# EAGLE design YOTSUBA_GNSS-coupler_ver.1.0 (EAGLE 9.6.2)
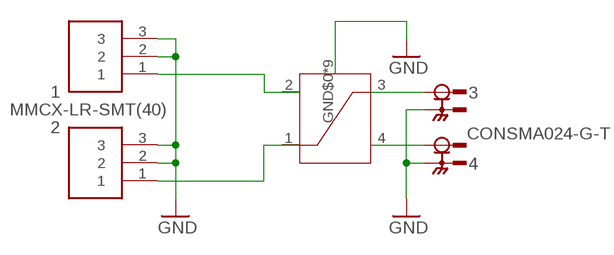
[diagram p0: schematic, sheet 1]

## Parts
1  MMCX-LR-SMT(40)  [MMCX-LR-SMT(40)]
2  MMCX-LR-SMT(40)  [MMCX-LR-SMT(40)]
3  CONSMA024-G-T  [LINX_CONSMA024-G-T]
4  CONSMA024-G-T  [LINX_CONSMA024-G-T]
U$3  HC125.A  [HC125.A]

## Nets
GND: 1.2 1.3 2.2 2.3 3.G1 3.G2 4.G1 4.G2 U$3.GND$0(GND) U$3.GND$1(GND) U$3.GND$2(GND) U$3.GND$3(GND) U$3.GND$4(GND) U$3.GND$5(GND) U$3.GND$6(GND) U$3.GND$7(GND) U$3.GND$8(GND)
N$1: 1.1 U$3.2
N$2: 2.1 U$3.1
N$3: 3.1 U$3.3
N$6: 4.1 U$3.4

## Library data of the parts
1 2 = MMCX-LR-SMT(40):MMCX-LR-SMT(40)
3 4 = CONSMA024-G-T:CONSMA024-G-T; DESCRIPTION: SMA, Edge Mount, Cutout, Female Receptacle, PCB Mount, Gold in Tape and Reel (500 per reel); DIGI-KEY_PART_NUMBER: 343-CONSMA024-G-TTR-ND; MF: Linx Technologies; MP: CONSMA024-G-T; PACKAGE: Custom Linx Technologies Inc.; PURCHASE-URL: https://pricing.snapeda.com/search/part/CONSMA024-G-T/?ref=eda
U$3 = HC125.A:HC125.A

## Net classes
0 default: clearance 0.121 mm

## Board
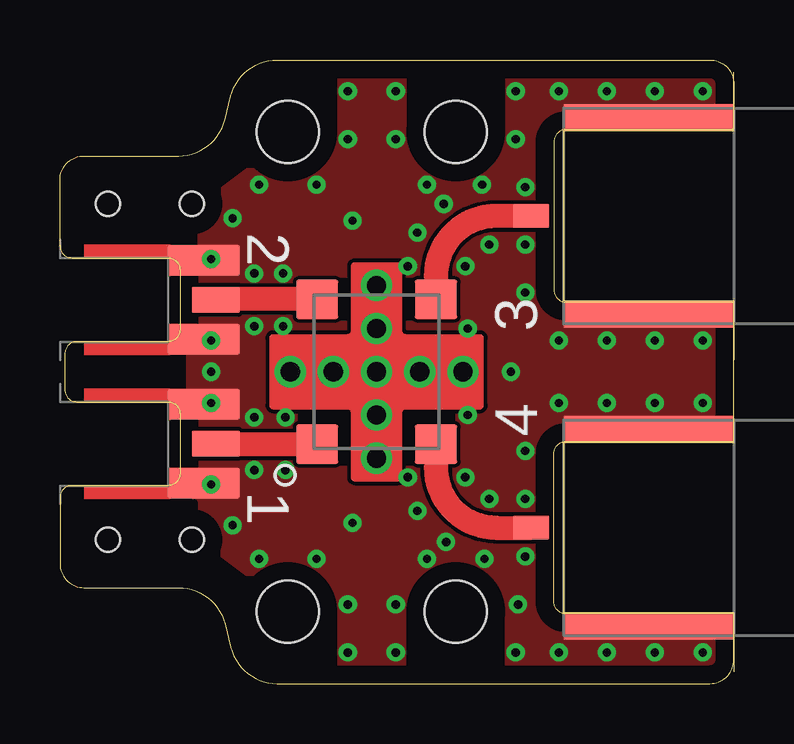
[diagram p1: board, top side]
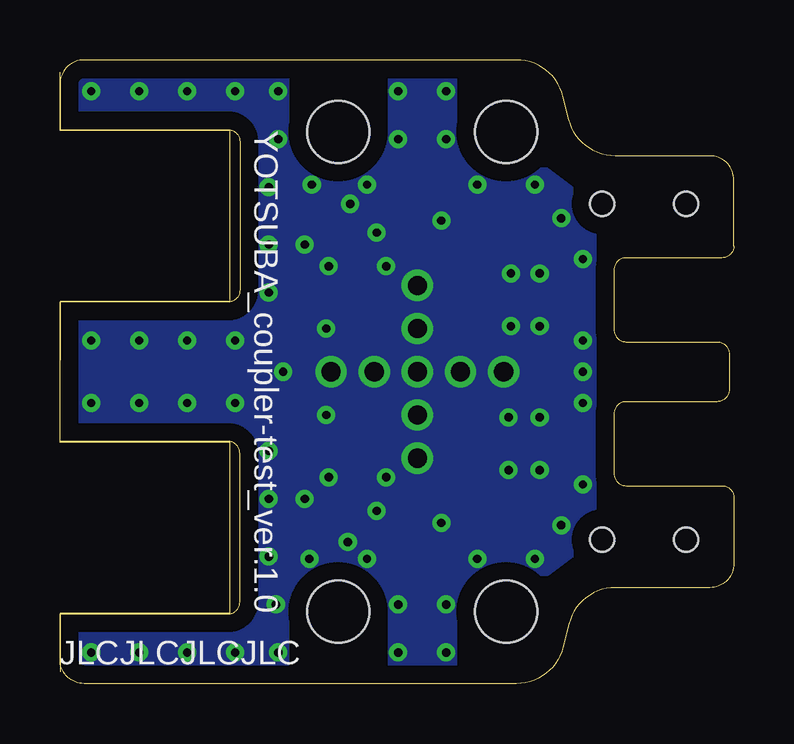
[diagram p2: board, bottom side, seen from below]

Size 28.1 x 26 mm. Coordinates in mm from the lower left corner, seen from the top.
Outline: 1,4 4.94,4 arc-76 6.88,2.48 7.12,1.51 arc76 9.06,0 27.1,0 arc90 28.1,1 28.1,2.9 21.1,2.9 arc-90 20.6,3.4 20.6,9.6 arc-90 21.1,10.1 28.1,10.1 28.1,15.9 21.1,15.9 arc-90 20.6,16.4 20.6,22.6 arc-90 21.1,23.1 28.1,23.1 28.1,25 arc90 27.1,26 9.06,26 arc76 7.12,24.48 6.88,23.52 arc-76 4.94,22 1,22 arc90 0,21 0,18.25 arc90 0.5,17.75 4.5,17.75 arc-90 5,17.25 5,14.75 arc-90 4.5,14.25 0.7,14.25 arc90 0.2,13.75 0.2,12.25 arc90 0.7,11.75 4.5,11.75 arc-90 5,11.25 5,8.75 arc-90 4.5,8.25 0.5,8.25 arc90 0,7.75 0,5 arc90 1,4
Copper layers (1*16): Top 0.035mm / dielectric 1.2mm / Bottom 0.035mm
Design rules "default *": minimum track width 6mil, minimum drill 0.35mm, track to track 6mil, track to pad 6mil, pad to pad 6mil, via to via 6mil, smd to smd 6mil, copper to edge 30mil, drill to drill 6mil, minimum pad ring 10mil, minimum via ring 8mil, stop-mask expansion 4mil, vias tented up to drill 30mil, thermal gap 10mil
Holes 1 mm at 2,6 5.5,6 2,20 5.5,20
Holes 2.6 mm at 9.5,3 9.5,23 16.5,23 16.5,3
tRestrict: 11 lines
bRestrict: 11 lines

### Footprints (pad centres in the part's own frame; a part is rotated, then mirrored left to right if it is on the bottom)
MMCX-LR-SMT(40) = smd 1.1 x 2: 1 0,-2 | smd 1.3 x 3: 2 1.65,-1.5; 3 -1.65,-1.5
LINX_CONSMA024-G-T = smd 1 x 1.5: 1 0,1.35 | smd 1.1 x 7.1: G1 -4.1,-3.55; G2 4.1,-3.55
HC125.A = smd 1.625 x 1.75: 1 -3.022,2.475; 2 3.022,2.475; 3 3.022,-2.475; 4 -3.022,-2.475 | drill 0.8: GND$0 0,0; GND$1 0,3.6; GND$2 0,1.8; GND$3 0,-3.6; GND$4 0,-1.8; GND$5 -3.6,0; GND$6 -1.8,0; GND$7 3.6,0; GND$8 1.8,0

### Placement (x,y rotation side)
1  4.5,16 90 top
2  4.5,10 90 top
3  21,19.5 90 top
4  21,6.5 90 top
U$3  13.2,13 90 top

### Tracks (layer width: path | path; a pad name or v marks a point on that pad's centre or on a via)
GND  (via drill 0.35)
  other vias: 26.8,14.3 26.8,11.7 24.8,14.3 22.8,14.3 20.8,14.3 24.8,11.7 22.8,11.7 20.8,11.7 26.8,1.3 24.8,1.3 22.8,1.3 20.8,1.3 26.8,24.7 24.8,24.7 22.8,24.7 20.8,24.7 19,24.7 19,1.3 14,24.7 12,24.7 14,1.3 12,1.3 12,3.3 14,3.3 19.1,3.3 19,22.7 14,22.7 12,22.7 19.4,20.7 19.4,18.3 19.4,16.3 19.4,5.3 19.4,9.7 19.4,7.7 15.3,20.8 17.6,20.8 10.7,20.8 8.3,20.8 17.7,5.2 15.3,5.2 10.7,5.2 8.3,5.2 6.3,14.3 6.3,11.7 6.3,17.7 6.3,8.3 6.3,13 7.2,19.4 7.2,6.6 17.9,7.7 17.9,18.3 16.9,17.4 14.5,17.4 14.9,18.8 16,20 16.9,8.6 14.5,8.6 14.9,7.2 16.1,5.9 17,14.8 17,11.2 9.4,11.1 9.3,14.9 9.4,8.9 9.3,17.1 8.1,17.1 8.1,14.9 8.1,11.1 8.1,8.9 12.2,6.7 12.2,19.3 18.8,13
  pour Top: -1.57,27.52 30.18,27.52 30.18,-1.58 -1.57,-1.58
  pour Bottom: -0.95,28.3 30.93,28.3 30.93,-0.83 -0.95,-0.83
N$1
  Top 1: U$3.2 6.5,16.02 1.1
N$2
  Top 1: U$3.1 6.2,9.98 6.22,10 2.1
  Top 1.1: U$3.1 11,9.98
N$3
  Top 1: 3.1 18.18,19.5 arc90 15.68,17 U$3.3
N$6
  Top 1: U$3.4 15.68,9 arc90 18.18,6.5 4.1

### Text on the board
tNames: 2 | 3 | 4 | 1
bNames: YOTSUBA_coupler-test_ver.1.0 | JLCJLCJLCJLC